# EAGLE board PIC32-HMZ144_Rev_C (EAGLE 4.16), part 1 of 2
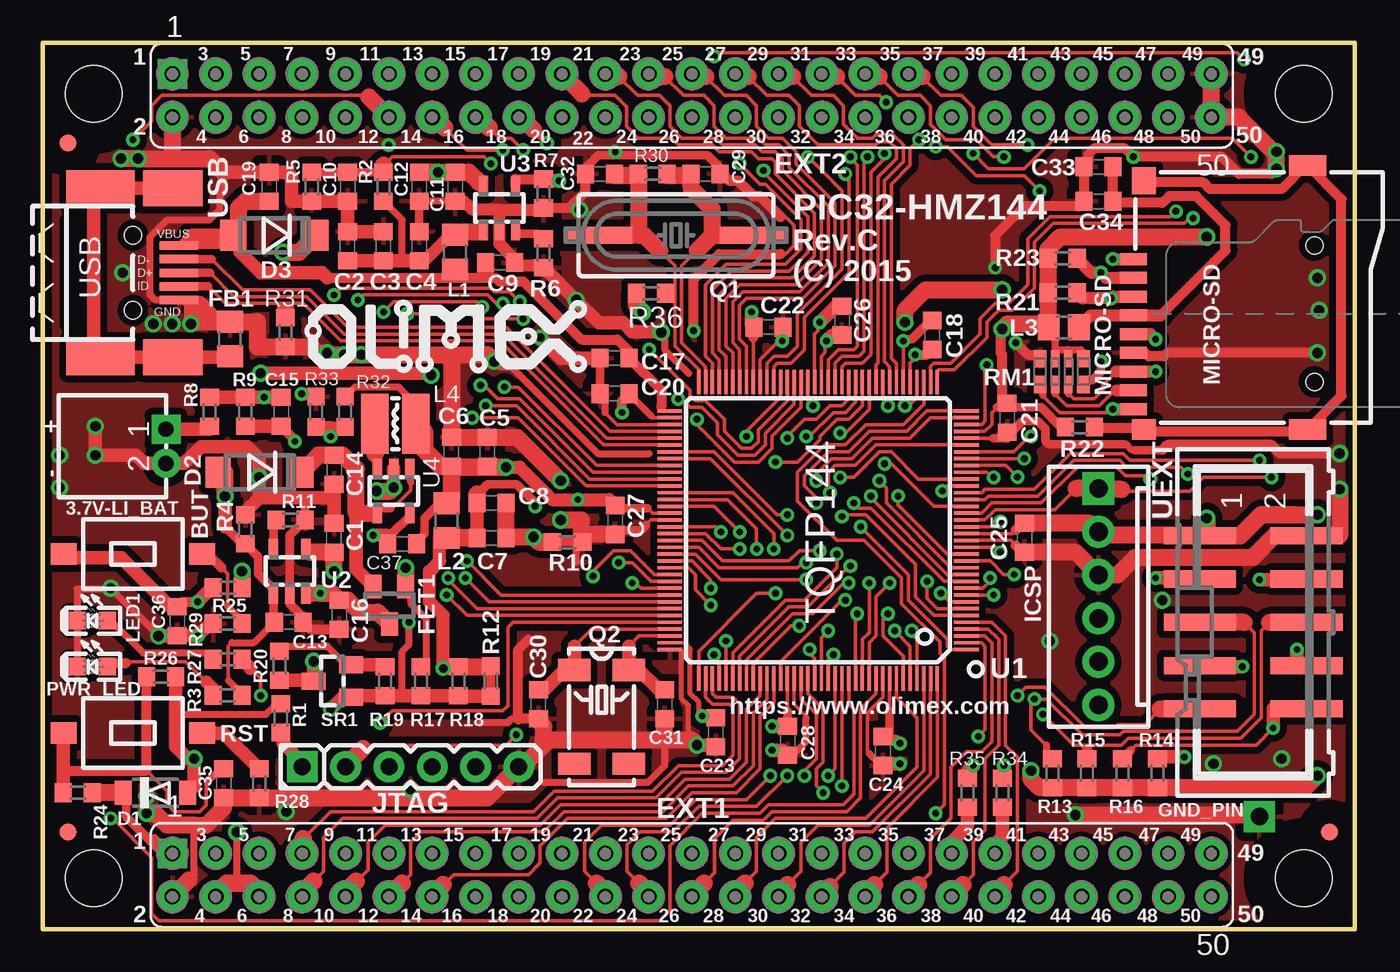
[diagram p2: board, top side]
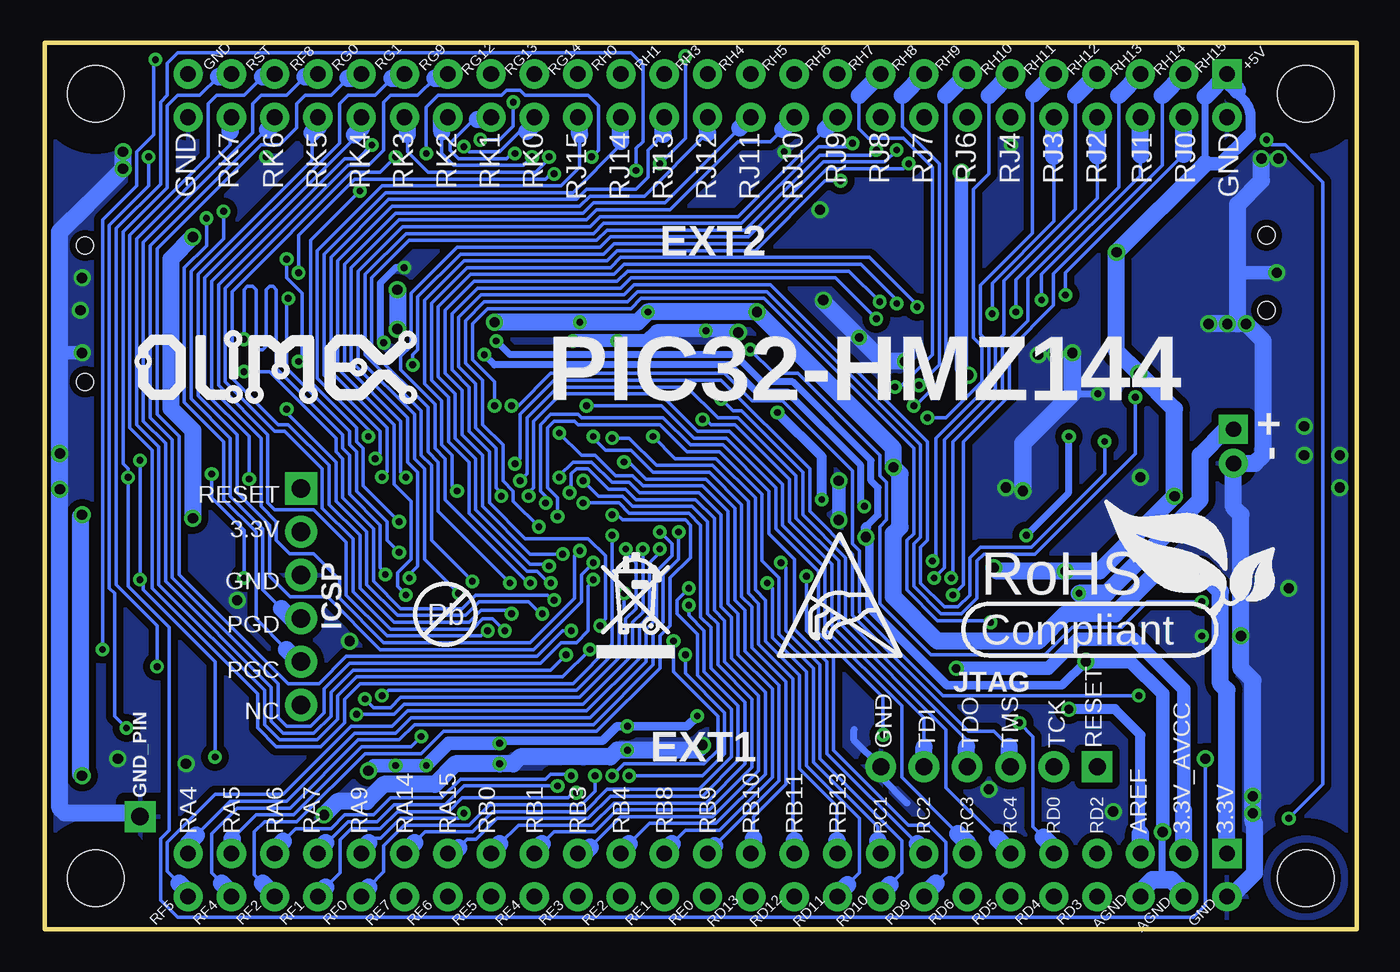
[diagram p3: board, bottom side, seen from below]

Size 77 x 52 mm. Coordinates in mm from the lower left corner, seen from the top.
Outline: 0,0 77,0 77,52 0,52 0,0
Copper layers (1*16): Top 0.035mm / dielectric 1.5mm / Bottom 0.035mm
Design rules "default": minimum track width 0.2mm, minimum drill 0.4mm, track to track 0.2mm, track to pad 0.2mm, pad to pad 0.2mm, via to via 0.2mm, smd to smd 1mil, copper to edge 10mil, drill to drill 8mil, minimum pad ring 0.4mm, minimum via ring 0.2mm, stop-mask expansion 4mil, vias tented up to drill 25mil, thermal gap 20mil
Holes 3.3 mm at 3,3 74,3 74,49 3,49
tRestrict: area 71,46 to 77,52; area 0,0 to 6,6; area 0,46 to 6,52; area 71,0 to 77,6
bRestrict: area 0,0 to 6,6; area 0,46 to 6,52; area 71,0 to 77,6; area 71,46 to 77,52

## Footprints (pad centres in the part's own frame; a part is rotated, then mirrored left to right if it is on the bottom)
DW02R = drill 0.9 square: 1 -1,0 | drill 0.9 round: 2 1,0
WS-TAKT_6X3.5_SMD_NOCREAM = smd 1.27 x 1.524: P$1 0,4.064; P$2 0,-4.064
C0603 = smd 1 x 1.1: 1 -0.85,0; 2 0.85,0
SOD-123 = smd 1 x 1.4: A 1.9,0; C -1.9,0
MLL-41 = smd 1.45 x 1.8: A 2.445,0; K -2.445,0
FE25-2 = drill 0.914 square: 1 -30.48,1.27 | drill 0.914 round: 2 -30.48,-1.27; 3 -27.94,1.27; 4 -27.94,-1.27; 5 -25.4,1.27; 6 -25.4,-1.27; 7 -22.86,1.27; 8 -22.86,-1.27; 9 -20.32,1.27; 10 -20.32,-1.27; 11 -17.78,1.27; 12 -17.78,-1.27; 13 -15.24,1.27; 14 -15.24,-1.27; 15 -12.7,1.27; 16 -12.7,-1.27; 17 -10.16,1.27; 18 -10.16,-1.27; 19 -7.62,1.27; 20 -7.62,-1.27; 21 -5.08,1.27; 22 -5.08,-1.27; 23 -2.54,1.27; 24 -2.54,-1.27; 25 0,1.27; 26 0,-1.27; 27 2.54,1.27; 28 2.54,-1.27; 29 5.08,1.27; 30 5.08,-1.27; 31 7.62,1.27; 32 7.62,-1.27; 33 10.16,1.27; 34 10.16,-1.27; 35 12.7,1.27; 36 12.7,-1.27; 37 15.24,1.27; 38 15.24,-1.27; 39 17.78,1.27; 40 17.78,-1.27; 41 20.32,1.27; 42 20.32,-1.27; 43 22.86,1.27; 44 22.86,-1.27; 45 25.4,1.27; 46 25.4,-1.27; 47 27.94,1.27; 48 27.94,-1.27; 49 30.48,1.27; 50 30.48,-1.27
L0805_5MIL_DWS = smd 1.27 x 1.524: 1 -1.016,0; 2 1.016,0
SOT23 = smd 1 x 1.4: 1 -0.95,-1.1; 2 0.95,-1.1; 3 0,1.1
TEST_PAD40/70/SQUARE = drill 1.016 pad 1.778 square: P$1 0,0
CON2.54MM-6-0D = drill 1.092 pad 1.778 square: 1 -6.35,0 | drill 1.092 pad 1.778 round: 2 -3.81,0; 3 -1.27,0; 4 1.27,0; 5 3.81,0; 6 6.35,0
HN1X6 = drill 1 pad 1.778 square: 1 -6.35,0 | drill 1 pad 1.778 round: 2 -3.81,0; 3 -1.27,0; 4 1.27,0; 5 3.81,0; 6 6.35,0
L0805 = smd 1.27 x 1.524: 1 -0.889,0; 2 0.889,0
CD32 = smd 1.6 x 3.5: 1 -1.2,0; 2 1.2,0
LED-0603 = smd 1.016 x 1.016: A 0.889,0; C -0.889,0
TFC-WPAPR-08 = smd 1.6 x 0.7: 1 -7.375,2.25; 2 -7.375,1.15; 3 -7.375,0.05; 4 -7.375,-1.05; 5 -7.375,-2.15; 6 -7.375,-3.25; 7 -7.375,-4.35; 8 -7.375,-5.45; 9 -7.375,-6.55 | smd 1.4 x 1.2: 10 -6.75,-7.75 | smd 1.4 x 1.6: 11 -6.75,6.85 | smd 2.2 x 1.2: 12 2.85,-7.75; 13 2.85,7.75 | hole 1: 3.25,-4.95; 3.25,3.05
HC49/SMD2_THIN&SHORT = smd 4 x 1: 1 -4.564,0; 2 4.564,0
MC-306 = smd 1.3 x 1.9: 1 -2.75,-1.6; 2 2.75,-1.6; 3 2.75,1.6; 4 -2.75,1.6
R0603 = smd 1 x 1.1: 1 -0.85,0; 2 0.85,0
0603_0R = smd 1.016 x 1.016: 1 -0.889,0; 2 0.889,0
R0603_5MIL_DWS = smd 1.016 x 1.016: 1 -0.889,0; 2 0.889,0
R_MATRIX_4 = smd 0.762 x 1.016: 1.1 -1.27,-0.762; 1.2 -1.27,0.762; 4.1 1.27,-0.762; 4.2 1.27,0.762 | smd 0.508 x 1.016: 2.1 -0.381,-0.762; 2.2 -0.381,0.762; 3.1 0.381,-0.762; 3.2 0.381,0.762
SOT-23 = smd 1.4 x 1: 1 1.1,-0.95; 2 1.1,0.95; 3 -1.1,0
TQFP144 = smd 0.2 x 1.45: 1 -7,-8.7; 2 -6.6,-8.7; 3 -6.2,-8.7; 4 -5.8,-8.7; 5 -5.4,-8.7; 6 -5,-8.7; 7 -4.6,-8.7; 8 -4.2,-8.7; 9 -3.8,-8.7; 10 -3.4,-8.7; 11 -3,-8.7; 12 -2.6,-8.7; 13 -2.2,-8.7; 14 -1.8,-8.7; 15 -1.4,-8.7; 16 -1,-8.7; 17 -0.6,-8.7; 18 -0.2,-8.7; 19 0.2,-8.7; 20 0.6,-8.7; 21 1,-8.7; 22 1.4,-8.7; 23 1.8,-8.7; 24 2.2,-8.7; 25 2.6,-8.7; 26 3,-8.7; 27 3.4,-8.7; 28 3.8,-8.7; 29 4.2,-8.7; 30 4.6,-8.7; 31 5,-8.7; 32 5.4,-8.7; 33 5.8,-8.7; 34 6.2,-8.7; 35 6.6,-8.7; 36 7,-8.7; 73 7,8.7; 74 6.6,8.7; 75 6.2,8.7; 76 5.8,8.7; 77 5.4,8.7; 78 5,8.7; 79 4.6,8.7; 80 4.2,8.7; 81 3.8,8.7; 82 3.4,8.7; 83 3,8.7; 84 2.6,8.7; 85 2.2,8.7; 86 1.8,8.7; 87 1.4,8.7; 88 1,8.7; 89 0.6,8.7; 90 0.2,8.7; 91 -0.2,8.7; 92 -0.6,8.7; 93 -1,8.7; 94 -1.4,8.7; 95 -1.8,8.7; 96 -2.2,8.7; 97 -2.6,8.7; 98 -3,8.7; 99 -3.4,8.7; 100 -3.8,8.7; 101 -4.2,8.7; 102 -4.6,8.7; 103 -5,8.7; 104 -5.4,8.7; 105 -5.8,8.7; 106 -6.2,8.7; 107 -6.6,8.7; 108 -7,8.7 | smd 1.45 x 0.2: 37 8.7,-7; 38 8.7,-6.6; 39 8.7,-6.2; 40 8.7,-5.8; 41 8.7,-5.4; 42 8.7,-5; 43 8.7,-4.6; 44 8.7,-4.2; 45 8.7,-3.8; 46 8.7,-3.4; 47 8.7,-3; 48 8.7,-2.6; 49 8.7,-2.2; 50 8.7,-1.8; 51 8.7,-1.4; 52 8.7,-1; 53 8.7,-0.6; 54 8.7,-0.2; 55 8.7,0.2; 56 8.7,0.6; 57 8.7,1; 58 8.7,1.4; 59 8.7,1.8; 60 8.7,2.2; 61 8.7,2.6; 62 8.7,3; 63 8.7,3.4; 64 8.7,3.8; 65 8.7,4.2; 66 8.7,4.6; 67 8.7,5; 68 8.7,5.4; 69 8.7,5.8; 70 8.7,6.2; 71 8.7,6.6; 72 8.7,7; 109 -8.7,7; 110 -8.7,6.6; 111 -8.7,6.2; 112 -8.7,5.8; 113 -8.7,5.4; 114 -8.7,5; 115 -8.7,4.6; 116 -8.7,4.2; 117 -8.7,3.8; 118 -8.7,3.4; 119 -8.7,3; 120 -8.7,2.6; 121 -8.7,2.2; 122 -8.7,1.8; 123 -8.7,1.4; 124 -8.7,1; 125 -8.7,0.6; 126 -8.7,0.2; 127 -8.7,-0.2; 128 -8.7,-0.6; 129 -8.7,-1; 130 -8.7,-1.4; 131 -8.7,-1.8; 132 -8.7,-2.2; 133 -8.7,-2.6; 134 -8.7,-3; 135 -8.7,-3.4; 136 -8.7,-3.8; 137 -8.7,-4.2; 138 -8.7,-4.6; 139 -8.7,-5; 140 -8.7,-5.4; 141 -8.7,-5.8; 142 -8.7,-6.2; 143 -8.7,-6.6; 144 -8.7,-7
SOT-23-5 = smd 1.2 x 0.55: 1 1.3,-0.95; 2 1.3,0; 3 1.3,0.95; 4 -1.3,0.95; 5 -1.3,-0.95
SOT23-5 = smd 1.2 x 0.55: 1 1.3,-0.95; 2 1.3,0; 3 1.3,0.95; 4 -1.3,0.95; 5 -1.3,-0.95
FIDUCIAL-1X3 = smd 1 x 1: 1 0,0
ML10_S = smd 1 x 4.25: 1 -5.08,-3.125; 2 -5.08,3.125; 3 -2.54,-3.125; 4 -2.54,3.125; 5 0,-3.125; 6 0,3.125; 7 2.54,-3.125; 8 2.54,3.125; 9 5.08,-3.125; 10 5.08,3.125
USB_MINI_9PIN = smd 2.25 x 0.5: D+ 2.706,0; D- 2.706,0.8; GND 2.706,-1.6; ID 2.706,-0.8; VBUS 2.706,1.6 | smd 4 x 2.1: GND1 -1.9,4.95; GND3 -1.9,-4.95 | smd 3.5 x 2.1: GND2 2.35,4.95; GND4 2.35,-4.95 | hole 1: 0,2.2; 0,-2.2

## Placement (x,y rotation side)
3.7V-LI_BAT  DW02R  [DW02R]  7.24,28.32 270 top
BUT  T1107A(6X3,8X2,5MM)  [WS-TAKT_6X3.5_SMD_NOCREAM]  5.3,22 90 top
C1  22uF/6.3V  [C0603]  17.1,22.95 90 top
C2  22uF/6.3V  [C0603]  17.9,40.05 90 top
C3  22uF/6.3V  [C0603]  20,40.05 90 top
C4  22uF/6.3V  [C0603]  22.1,40.05 90 top
C5  100nF  [C0603]  26.1,28 90 top
C6  22uF/6.3V  [C0603]  24,28 90 top
C7  10uF/6.3V  [C0603]  26.35,22.95 0 top
C8  10nF  [C0603]  26.35,25 0 top
C9  100nF  [C0603]  26.85,39.1 0 top
C10  100nF  [C0603]  17.9,43.55 270 top
C11  100nF  [C0603]  24.2,43.55 270 top
C12  22uF/6.3V  [C0603]  22.1,43.55 270 top
C13  10uF/6.3V  [C0603]  14.45,18 0 top
C14  22uF/6.3V  [C0603]  17.1,26.95 270 top
C15  10nF  [C0603]  14,30.35 270 top
C16  10uF/6.3V  [C0603]  17.4,18.45 270 top
C17  10uF/6.3V  [C0603]  33.55,33.5 180 top
C18  100nF  [C0603]  52.2,34.85 90 top
C19  100nF  [C0603]  13.3,43.55 270 top
C20  100nF  [C0603]  33.55,31.4 0 top
C21  100nF  [C0603]  56.6,30 270 top
C22  100nF  [C0603]  42.6,35.3 0 top
C23  100nF  [C0603]  39.5,11.55 270 top
C24  100nF  [C0603]  49.3,10.45 270 top
C25  10uF/6.3V  [C0603]  57.6,22.95 270 top
C26  100nF  [C0603]  46.9,35.7 270 top
C27  100nF  [C0603]  33.6,24 270 top
C28  100nF  [C0603]  43.7,11.05 270 top
C29  20pF  [C0603]  38.9,44.3 180 top
C30  10pF  [C0603]  29.1,13.2 90 top
C31  10pF  [C0603]  36.5,13.2 90 top
C32  20pF  [C0603]  32.7,44.3 0 top
C33  22uF/6.3V  [C0603]  61.95,44.73 180 top
C34  22uF/6.3V  [C0603]  61.95,42.7 180 top
C35  100nF  [C0603]  10.62,8.55 270 top
C36  NA(100nF)  [C0603]  7.9,18.05 270 top
C37  27pF  [C0603]  21.1,22.6 180 top
D1  1N5819(S4SOD-123)  [SOD-123]  6.62,8 0 top
D2  1N5819(SS14)  [MLL-41]  12.74,26.8 180 top
D3  1N5819(SS14)  [MLL-41]  13.6,40.7 180 top
EXT1  NA  [FE25-2]  38.1,3.17 0 top
EXT2  NA  [FE25-2]  38.1,48.9 0 top
FB1  FB0805/600R/2A  [L0805_5MIL_DWS]  11,34.62 270 top
FET1  IRLML6402  [SOT23]  20.35,19 180 top
GND_PIN  TESTPAD3  [TEST_PAD40/70/SQUARE]  71.4,6.6 0 top
ICSP  WF6S  [CON2.54MM-6-0D]  61.95,19.5 270 top
JTAG  NA(HN1X6)  [HN1X6]  21.59,9.53 0 top
L1  FB0805/600R/2A  [L0805_5MIL_DWS]  24.2,39.71 90 top
L2  FB0805/600R/2A  [L0805_5MIL_DWS]  23.7,23.97 270 top
L3  CL470nH/0805/1.76R/250mA  [L0805]  59.91,35.3 0 top
L4  2.2uH/1.5A/DCR<0.1R/CD32  [CD32]  20.7,29.65 0 top
LED1  LED/GREEN/0603  [LED-0603]  2.92,18.1 0 top
MICRO-SD  TFC-WPAPR-08  [TFC-WPAPR-08]  71.38,37.05 0 top
PWR_LED  LED/RED/0603  [LED-0603]  2.92,15.4 0 top
Q1  Q12.000MHz/HC-49S/SMD/20pF/30ppm  [HC49/SMD2_THIN&SHORT]  37.16,40.7 0 top
Q2  MC-306_32.768KHz/6pF  [MC-306]  32.8,12.45 270 top
R1  330R  [R0603]  13.98,12.38 90 top
R2  47k  [R0603]  20,43.55 270 top
R3  1k  [R0603]  10.85,13.73 180 top
R4  10k  [R0603]  11.9,23.45 90 top
R5  100k  [R0603]  15.8,43.55 90 top
R6  13k/1%  [R0603]  29.4,39.65 90 top
R7  100k  [R0603]  29.4,43.15 90 top
R8  3M  [R0603]  9.8,30.35 90 top
R9  1M/1%  [R0603]  11.9,30.35 90 top
R10  0R(Board_Mounted)  [0603_0R]  30.8,22.7 180 top
R11  15k  [R0603]  14.55,24 180 top
R12  0R(Board_Mounted)  [0603_0R]  26.3,14.55 270 top
R13  2.2k  [R0603]  59.25,9.15 270 top
R14  47k  [R0603]  65.4,9.15 270 top
R15  2.2k  [R0603]  61.27,9.15 270 top
R16  47k  [R0603]  63.35,9.15 270 top
R17  NA  [R0603]  22.2,14.55 90 top
R18  NA  [R0603]  24.4,14.55 90 top
R19  NA  [R0603]  20.1,14.55 270 top
R20  NA  [R0603]  13.9,15.45 90 top
R21  10k  [R0603]  59.85,37.33 180 top
R22  1k  [R0603]  60.85,29.45 180 top
R23  100k  [R0603]  59.85,39.35 180 top
R24  10k  [R0603]  2.07,8 180 top
R25  10k  [R0603]  10.85,20.03 180 top
R26  330R  [R0603]  6.95,14.8 0 top
R27  1k  [R0603]  10.85,15.83 0 top
R28  330R  [R0603]  12.72,8.55 90 top
R29  330R  [R0603]  10.85,17.93 0 top
R30  1M/1%  [R0603]  35.8,44.3 0 top
R31  NA  [R0603]  14.25,35 90 top
R32  4.99k/1%  [R0603_5MIL_DWS]  17.75,30.35 270 top
R33  1.1k/1%  [R0603_5MIL_DWS]  16.05,30.35 90 top
R34  NA  [R0603]  56.31,8 270 top
R35  NA  [R0603]  54.26,8 270 top
R36  10k  [R0603]  35.7,37.3 0 top
RM1  RA1206_(4X0603)-100k  [R_MATRIX_4]  59.8,32.7 0 top
RST  T1107A(6X3,8X2,5MM)  [WS-TAKT_6X3.5_SMD_NOCREAM]  5.3,11.5 90 top
SR1  NA(AP431SA)  [SOT-23]  17,14.55 0 top
U1  PIC32MZ2048ECG144-I/PH  [TQFP144]  45.5,23.4 90 top
U2  MCP73812T-420I/OT  [SOT-23-5]  14.5,21 270 top
U3  SY6280  [SOT23-5]  26.8,42.3 270 top
U4  SY8009AAAC(SOT23-5)  [SOT23-5]  20.6,25.7 90 top
U$1  FIDUCIAL  [FIDUCIAL-1X3]  1.5,5.7 90 top
U$2  FIDUCIAL  [FIDUCIAL-1X3]  75.5,5.7 90 top
U$3  FIDUCIAL  [FIDUCIAL-1X3]  1.5,46.1 90 top
U$4  [OLIMEX1_V]  33.1,32.5 0 top
U$5  [PB_SMALL]  53.48,18.48 0 bottom
U$6  [RECYCLE_BIN1/8]  44.6,15.9 0 bottom
U$7  [ESD_SYMBOL]  33.9,16.05 0 bottom
U$10  [ROHS]  22.08,16.68 0 bottom
U$11  [OLIMEX1_V]  54,30.7 0 bottom
UEXT  GBH-254-SMT-10  [ML10_S]  71.03,18 270 top
USB  USB-OTG  [USB_MINI_9PIN]  5.3,38.5 0 top